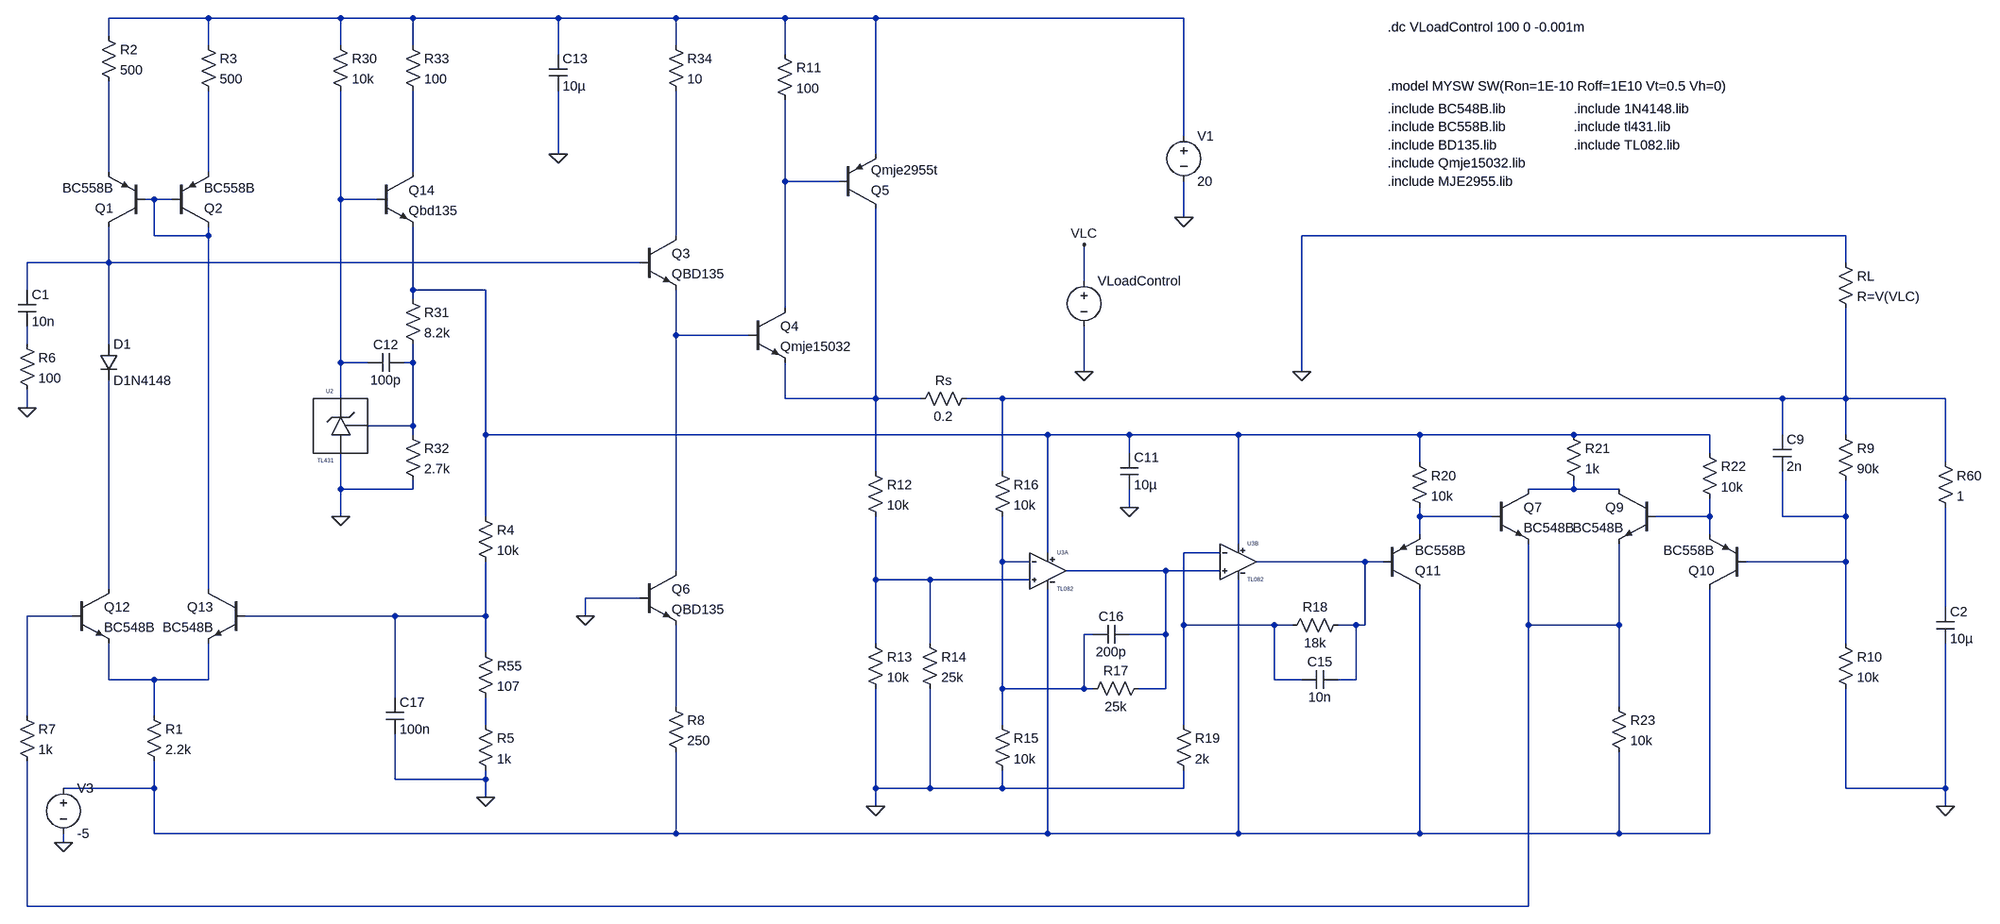
[diagram p0: schematic power_supply_load_regulation.asc]
power_supply_load_regulation.asc, the LTspice schematic file:
Version 4
SHEET 1 3040 1240
WIRE -1616 -752 -1792 -752
WIRE -1328 -752 -1616 -752
WIRE -1200 -752 -1328 -752
WIRE -944 -752 -1200 -752
WIRE -736 -752 -944 -752
WIRE -544 -752 -736 -752
WIRE -384 -752 -544 -752
WIRE 160 -752 -384 -752
WIRE -1792 -720 -1792 -752
WIRE -1616 -704 -1616 -752
WIRE -1328 -704 -1328 -752
WIRE -1200 -704 -1200 -752
WIRE -736 -704 -736 -752
WIRE -944 -688 -944 -752
WIRE -544 -688 -544 -752
WIRE 160 -544 160 -752
WIRE -944 -512 -944 -624
WIRE -384 -512 -384 -752
WIRE -1792 -480 -1792 -640
WIRE -1616 -480 -1616 -624
WIRE -1200 -480 -1200 -624
WIRE -544 -464 -544 -608
WIRE -448 -464 -544 -464
WIRE -1712 -432 -1728 -432
WIRE -1680 -432 -1712 -432
WIRE -1328 -432 -1328 -624
WIRE -1264 -432 -1328 -432
WIRE 160 -400 160 -464
WIRE -1712 -368 -1712 -432
WIRE -1616 -368 -1616 -384
WIRE -1616 -368 -1712 -368
WIRE -736 -368 -736 -624
WIRE 1328 -368 368 -368
WIRE -1792 -320 -1792 -384
WIRE -1792 -320 -1936 -320
WIRE -800 -320 -1792 -320
WIRE 1328 -320 1328 -368
WIRE -16 -288 -16 -352
WIRE -1936 -272 -1936 -320
WIRE -1200 -272 -1200 -384
WIRE -1072 -272 -1200 -272
WIRE -1200 -256 -1200 -272
WIRE -544 -240 -544 -464
WIRE -736 -192 -736 -272
WIRE -608 -192 -736 -192
WIRE -1936 -176 -1936 -208
WIRE -1792 -176 -1792 -320
WIRE -1328 -144 -1328 -432
WIRE -1280 -144 -1328 -144
WIRE -1200 -144 -1200 -176
WIRE -1200 -144 -1216 -144
WIRE -16 -128 -16 -208
WIRE 368 -128 368 -368
WIRE -1328 -80 -1328 -144
WIRE -544 -80 -544 -144
WIRE -384 -80 -384 -416
WIRE -384 -80 -544 -80
WIRE -304 -80 -384 -80
WIRE -160 -80 -224 -80
WIRE 1216 -80 -160 -80
WIRE 1328 -80 1328 -240
WIRE 1328 -80 1216 -80
WIRE 1504 -80 1328 -80
WIRE -1936 -64 -1936 -96
WIRE -1200 -32 -1200 -144
WIRE -1200 -32 -1280 -32
WIRE -1200 -16 -1200 -32
WIRE -1072 -16 -1072 -272
WIRE -80 -16 -1072 -16
WIRE 64 -16 -80 -16
WIRE 256 -16 64 -16
WIRE 576 -16 256 -16
WIRE 848 -16 576 -16
WIRE 1088 -16 848 -16
WIRE 1216 -16 1216 -80
WIRE 1328 -16 1328 -80
WIRE 64 16 64 -16
WIRE 1088 16 1088 -16
WIRE 576 32 576 -16
WIRE 1504 32 1504 -80
WIRE -384 48 -384 -80
WIRE -160 48 -160 -80
WIRE -1328 80 -1328 16
WIRE -1200 80 -1200 64
WIRE -1200 80 -1328 80
WIRE 848 80 848 64
WIRE 848 80 768 80
WIRE 928 80 848 80
WIRE 64 112 64 80
WIRE -1328 128 -1328 80
WIRE -1072 128 -1072 -16
WIRE 576 128 576 112
WIRE 704 128 576 128
WIRE 1088 128 1088 96
WIRE 1088 128 992 128
WIRE 1216 128 1216 48
WIRE 1328 128 1328 64
WIRE 1328 128 1216 128
WIRE 576 160 576 128
WIRE 1088 160 1088 128
WIRE 256 176 256 -16
WIRE -80 192 -80 -16
WIRE 224 192 160 192
WIRE -160 208 -160 128
WIRE -112 208 -160 208
WIRE 480 208 288 208
WIRE 512 208 480 208
WIRE 1328 208 1328 128
WIRE 1328 208 1152 208
WIRE -736 224 -736 -192
WIRE 128 224 -48 224
WIRE 224 224 128 224
WIRE -384 240 -384 128
WIRE -288 240 -384 240
WIRE -112 240 -288 240
WIRE -1792 256 -1792 -112
WIRE -1616 256 -1616 -368
WIRE -800 272 -896 272
WIRE 1504 288 1504 112
WIRE -1856 304 -1936 304
WIRE -1232 304 -1552 304
WIRE -1072 304 -1072 208
WIRE -1072 304 -1232 304
WIRE -896 304 -896 272
WIRE 160 320 160 192
WIRE 320 320 160 320
WIRE 352 320 320 320
WIRE 464 320 432 320
WIRE 480 320 480 208
WIRE 480 320 464 320
WIRE 768 320 768 176
WIRE 928 320 928 176
WIRE 928 320 768 320
WIRE 0 336 -16 336
WIRE 128 336 128 224
WIRE 128 336 64 336
WIRE -384 352 -384 240
WIRE -288 352 -288 240
WIRE 1328 352 1328 208
WIRE -1072 368 -1072 304
WIRE -1792 416 -1792 352
WIRE -1712 416 -1792 416
WIRE -1616 416 -1616 352
WIRE -1616 416 -1712 416
WIRE 320 416 320 320
WIRE 368 416 320 416
WIRE 464 416 464 320
WIRE 464 416 432 416
WIRE -160 432 -160 208
WIRE -16 432 -16 336
WIRE -16 432 -160 432
WIRE 0 432 -16 432
WIRE 128 432 128 336
WIRE 128 432 80 432
WIRE -1232 448 -1232 304
WIRE -736 464 -736 320
WIRE 928 464 928 320
WIRE -1936 480 -1936 304
WIRE -1712 480 -1712 416
WIRE -1072 496 -1072 448
WIRE -160 496 -160 432
WIRE 160 496 160 320
WIRE -1232 592 -1232 512
WIRE -1072 592 -1072 576
WIRE -1072 592 -1232 592
WIRE -1712 608 -1712 560
WIRE -1712 608 -1872 608
WIRE -384 608 -384 432
WIRE -288 608 -288 432
WIRE -288 608 -384 608
WIRE -160 608 -160 576
WIRE -160 608 -288 608
WIRE 160 608 160 576
WIRE 160 608 -160 608
WIRE 1328 608 1328 432
WIRE 1504 608 1504 352
WIRE 1504 608 1328 608
WIRE -1072 624 -1072 592
WIRE -384 640 -384 608
WIRE 1504 640 1504 608
WIRE -1712 688 -1712 608
WIRE -736 688 -736 544
WIRE -736 688 -1712 688
WIRE -80 688 -80 256
WIRE -80 688 -736 688
WIRE 256 688 256 240
WIRE 256 688 -80 688
WIRE 576 688 576 256
WIRE 576 688 256 688
WIRE 928 688 928 544
WIRE 928 688 576 688
WIRE 1088 688 1088 256
WIRE 1088 688 928 688
WIRE -1872 704 -1872 688
WIRE -1936 816 -1936 560
WIRE 768 816 768 320
WIRE 768 816 -1936 816
FLAG -384 640 0
FLAG 1504 640 0
FLAG 160 -400 0
FLAG -944 -512 0
FLAG -896 304 0
FLAG 64 112 0
FLAG -1072 624 0
FLAG -1936 -64 0
FLAG -1328 128 0
FLAG -1872 704 0
FLAG 368 -128 0
FLAG -16 -128 0
FLAG -16 -352 VLC
DATAFLAG -1920 304 ""
DATAFLAG -1488 304 ""
DATAFLAG -1792 160 ""
DATAFLAG -1792 -240 ""
DATAFLAG -1616 -240 ""
DATAFLAG -976 -16 ""
DATAFLAG 1472 -80 ""
DATAFLAG -1328 -432 ""
DATAFLAG -1712 416 ""
DATAFLAG -1200 -544 ""
DATAFLAG -736 112 "Ic(Q6)"
DATAFLAG -736 -176 ""
DATAFLAG -736 416 ""
DATAFLAG -384 240 ""
DATAFLAG -160 320 ""
DATAFLAG 32 224 ""
DATAFLAG 160 432 ""
DATAFLAG 368 208 ""
DATAFLAG 656 128 ""
DATAFLAG 768 272 ""
DATAFLAG 928 80 ""
DATAFLAG 1040 128 ""
DATAFLAG 1216 208 ""
DATAFLAG 448 688 ""
DATAFLAG -128 -752 ""
DATAFLAG -736 -512 ""
DATAFLAG -544 -496 ""
DATAFLAG -384 -160 ""
DATAFLAG -1792 -560 ""
DATAFLAG -1616 -544 ""
DATAFLAG -1616 0 "Ic(Q13)"
DATAFLAG -1792 -16 "Ic(Q12)"
DATAFLAG -384 -368 "Ic(Q5)"
DATAFLAG 1328 -208 "-I(RL)"
DATAFLAG -1200 -304 "-Ie(Q14)"
DATAFLAG -1072 80 "I(R4)"
DATAFLAG -1328 -224 "Ix(U2:CATHODE)"
SYMBOL TL082 -80 160 R0
SYMATTR InstName U3A
SYMBOL res 96 416 R90
WINDOW 0 0 56 VBottom 2
WINDOW 3 32 56 VTop 2
SYMATTR InstName R17
SYMATTR Value 25k
SYMBOL cap 64 320 R90
WINDOW 0 0 32 VBottom 2
WINDOW 3 32 32 VTop 2
SYMATTR InstName C16
SYMATTR Value 200p
SYMBOL res -176 32 R0
SYMATTR InstName R16
SYMATTR Value 10k
SYMBOL res -176 480 R0
SYMATTR InstName R15
SYMATTR Value 10k
SYMBOL res -208 -96 R90
WINDOW 0 0 56 VBottom 2
WINDOW 3 32 56 VTop 2
SYMATTR InstName Rs
SYMATTR Value 0.2
SYMBOL TL082 256 144 R0
SYMATTR InstName U3B
SYMBOL res 448 304 R90
WINDOW 0 0 56 VBottom 2
WINDOW 3 32 56 VTop 2
SYMATTR InstName R18
SYMATTR Value 18k
SYMBOL cap 432 400 R90
WINDOW 0 0 32 VBottom 2
WINDOW 3 32 32 VTop 2
SYMATTR InstName C15
SYMATTR Value 10n
SYMBOL res 144 480 R0
SYMATTR InstName R19
SYMATTR Value 2k
SYMBOL res -304 336 R0
SYMATTR InstName R14
SYMATTR Value 25k
SYMBOL res -400 336 R0
SYMATTR InstName R13
SYMATTR Value 10k
SYMBOL res -400 32 R0
SYMATTR InstName R12
SYMATTR Value 10k
SYMBOL res 560 16 R0
SYMATTR InstName R20
SYMATTR Value 10k
SYMBOL npn 704 80 R0
SYMATTR InstName Q7
SYMATTR Value BC548B
SYMBOL npn 992 80 M0
SYMATTR InstName Q9
SYMATTR Value BC548B
SYMBOL res 832 -32 R0
SYMATTR InstName R21
SYMATTR Value 1k
SYMBOL res 912 448 R0
SYMATTR InstName R23
SYMATTR Value 10k
SYMBOL res 1072 0 R0
SYMATTR InstName R22
SYMATTR Value 10k
SYMBOL pnp 512 256 M180
SYMATTR InstName Q11
SYMATTR Value BC558B
SYMBOL pnp 1152 256 R180
SYMATTR InstName Q10
SYMATTR Value BC558B
SYMBOL res 1312 -32 R0
SYMATTR InstName R9
SYMATTR Value 90k
SYMBOL cap 1200 -16 R0
SYMATTR InstName C9
SYMATTR Value 2n
SYMBOL res 1312 336 R0
SYMATTR InstName R10
SYMATTR Value 10k
SYMBOL cap 1488 288 R0
SYMATTR InstName C2
SYMATTR Value 10µ
SYMBOL res 1488 16 R0
SYMATTR InstName R60
SYMATTR Value 1
SYMBOL pnp -448 -416 M180
SYMATTR InstName Q5
SYMATTR Value Qmje2955t
SYMBOL voltage 160 -560 R0
SYMATTR InstName V1
SYMATTR Value 20
SYMBOL res -560 -704 R0
SYMATTR InstName R11
SYMATTR Value 100
SYMBOL npn -608 -240 R0
SYMATTR InstName Q4
SYMATTR Value Qmje15032
SYMBOL npn -800 -368 R0
SYMATTR InstName Q3
SYMATTR Value QBD135
SYMBOL cap -960 -688 R0
SYMATTR InstName C13
SYMATTR Value 10µ
SYMBOL npn -800 224 R0
SYMATTR InstName Q6
SYMATTR Value QBD135
SYMBOL res -752 448 R0
SYMATTR InstName R8
SYMATTR Value 250
SYMBOL cap 48 16 R0
SYMATTR InstName C11
SYMATTR Value 10µ
SYMBOL res -1088 112 R0
SYMATTR InstName R4
SYMATTR Value 10k
SYMBOL res -1088 352 R0
SYMATTR InstName R55
SYMATTR Value 107
SYMBOL res -1088 480 R0
SYMATTR InstName R5
SYMATTR Value 1k
SYMBOL cap -1248 448 R0
SYMATTR InstName C17
SYMATTR Value 100n
SYMBOL npn -1856 256 R0
SYMATTR InstName Q12
SYMATTR Value BC548B
SYMBOL npn -1552 256 M0
SYMATTR InstName Q13
SYMATTR Value BC548B
SYMBOL res -1728 464 R0
SYMATTR InstName R1
SYMATTR Value 2.2k
SYMBOL diode -1808 -176 R0
SYMATTR InstName D1
SYMATTR Value D1N4148
SYMBOL pnp -1728 -384 R180
SYMATTR InstName Q1
SYMATTR Value BC558B
SYMBOL pnp -1680 -384 M180
SYMATTR InstName Q2
SYMATTR Value BC558B
SYMBOL res -1808 -736 R0
SYMATTR InstName R2
SYMATTR Value 500
SYMBOL res -1632 -720 R0
SYMATTR InstName R3
SYMATTR Value 500
SYMBOL cap -1952 -272 R0
SYMATTR InstName C1
SYMATTR Value 10n
SYMBOL res -1952 -192 R0
SYMATTR InstName R6
SYMATTR Value 100
SYMBOL res -1344 -720 R0
SYMATTR InstName R30
SYMATTR Value 10k
SYMBOL npn -1264 -480 R0
SYMATTR InstName Q14
SYMATTR Value Qbd135
SYMBOL res -1216 -272 R0
SYMATTR InstName R31
SYMATTR Value 8.2k
SYMBOL res -1216 -32 R0
SYMATTR InstName R32
SYMATTR Value 2.7k
SYMBOL cap -1216 -160 R90
WINDOW 0 0 32 VBottom 2
WINDOW 3 32 32 VTop 2
SYMATTR InstName C12
SYMATTR Value 100p
SYMBOL TL431 -1328 -32 M0
SYMATTR InstName U2
SYMBOL res -1952 464 R0
SYMATTR InstName R7
SYMATTR Value 1k
SYMBOL res 1312 -336 R0
SYMATTR InstName RL
SYMATTR Value R=V(VLC)
SYMBOL voltage -1872 592 R0
SYMATTR InstName V3
SYMATTR Value -5
SYMBOL res -1216 -720 R0
SYMATTR InstName R33
SYMATTR Value 100
SYMBOL res -752 -720 R0
SYMATTR InstName R34
SYMATTR Value 10
SYMBOL voltage -16 -304 R0
WINDOW 123 0 0 Left 0
WINDOW 39 0 0 Left 0
SYMATTR InstName VLoadControl
SYMATTR Value ""
TEXT 520 -560 Left 2 !.include BC558B.lib
TEXT 848 -528 Left 2 !.include TL082.lib
TEXT 520 -592 Left 2 !.include BC548B.lib
TEXT 520 -464 Left 2 !.include MJE2955.lib
TEXT 520 -528 Left 2 !.include BD135.lib
TEXT 848 -592 Left 2 !.include 1N4148.lib
TEXT 848 -560 Left 2 !.include tl431.lib
TEXT 520 -496 Left 2 !.include Qmje15032.lib
TEXT 520 -736 Left 2 !.dc VLoadControl 100 0 -0.001m
TEXT 520 -632 Left 2 !.model MYSW SW(Ron=1E-10 Roff=1E10 Vt=0.5 Vh=0)

The netlist it stands for:
* power_supply_load_regulation.asc
XU3A N024 N021 N010 N033 N023 TL082  ; pins In+ In- V+ V- OUT
R17 N023 N021 25k
C16 N023 N021 200p
R16 N015 N021 10k
R15 N021 0 10k
Rs N015 N014 0.2
XU3B N023 N020 N010 N033 N022 TL082  ; pins In+ In- V+ V- OUT
R18 N022 N020 18k
C15 N022 N020 10n
R19 N020 0 2k
R14 N024 0 25k
R13 N024 0 10k
R12 N014 N024 10k
R20 N010 N017 10k
Q7 N016 N017 N029 0 BC548B
Q9 N016 N018 N029 0 BC548B
R21 N010 N016 1k
R23 N029 N033 10k
R22 N010 N018 10k
Q11 N033 N022 N017 0 BC558B
Q10 N033 N019 N018 0 BC558B
R9 N015 N019 90k
C9 N015 N019 2n
R10 N019 0 10k
C2 N026 0 10µ
R60 N015 N026 1
Q5 N014 N005 N001 0 Qmje2955t
V1 N001 0 20
R11 N001 N005 100
Q4 N005 N011 N014 0 Qmje15032
Q3 N008 N009 N011 0 QBD135
C13 N001 0 10µ
Q6 N011 0 N031 0 QBD135
R8 N031 N033 250
C11 N010 0 10µ
R4 N010 N028 10k
R55 N028 N032 107
R5 N032 0 1k
C17 N028 0 100n
Q12 N025 N027 N030 0 BC548B
Q13 N006 N028 N030 0 BC548B
R1 N030 N033 2.2k
D1 N009 N025 D1N4148
Q1 N009 N006 N002 0 BC558B
Q2 N006 N006 N003 0 BC558B
R2 N001 N002 500
R3 N001 N003 500
C1 N009 N012 10n
R6 N012 0 100
R30 N001 N007 10k
Q14 N004 N007 N010 0 Qbd135
R31 N010 N013 8.2k
R32 N013 0 2.7k
C12 N013 N007 100p
XU2 N007 0 N013 TL431  ; pins CATHODE ANODE REF
R7 N027 N029 1k
RL 0 N015 R=V(VLC)
V3 N033 0 -5
R33 N001 N004 100
R34 N001 N008 10
VLoadControl VLC 0
.model D D
.lib standard.dio
.model NPN NPN
.model PNP PNP
.lib standard.bjt
.include BC558B.lib
.include TL082.lib
.include BC548B.lib
.include MJE2955.lib
.include BD135.lib
.include 1N4148.lib
.include tl431.lib
.include Qmje15032.lib
.dc VLoadControl 100 0 -0.001m
.model MYSW SW(Ron=1E-10 Roff=1E10 Vt=0.5 Vh=0)
.lib TL082.lib
.lib tl431.lib
.backanno
.end